# EAGLE design cvpal_v01 (EAGLE 9.7.0)
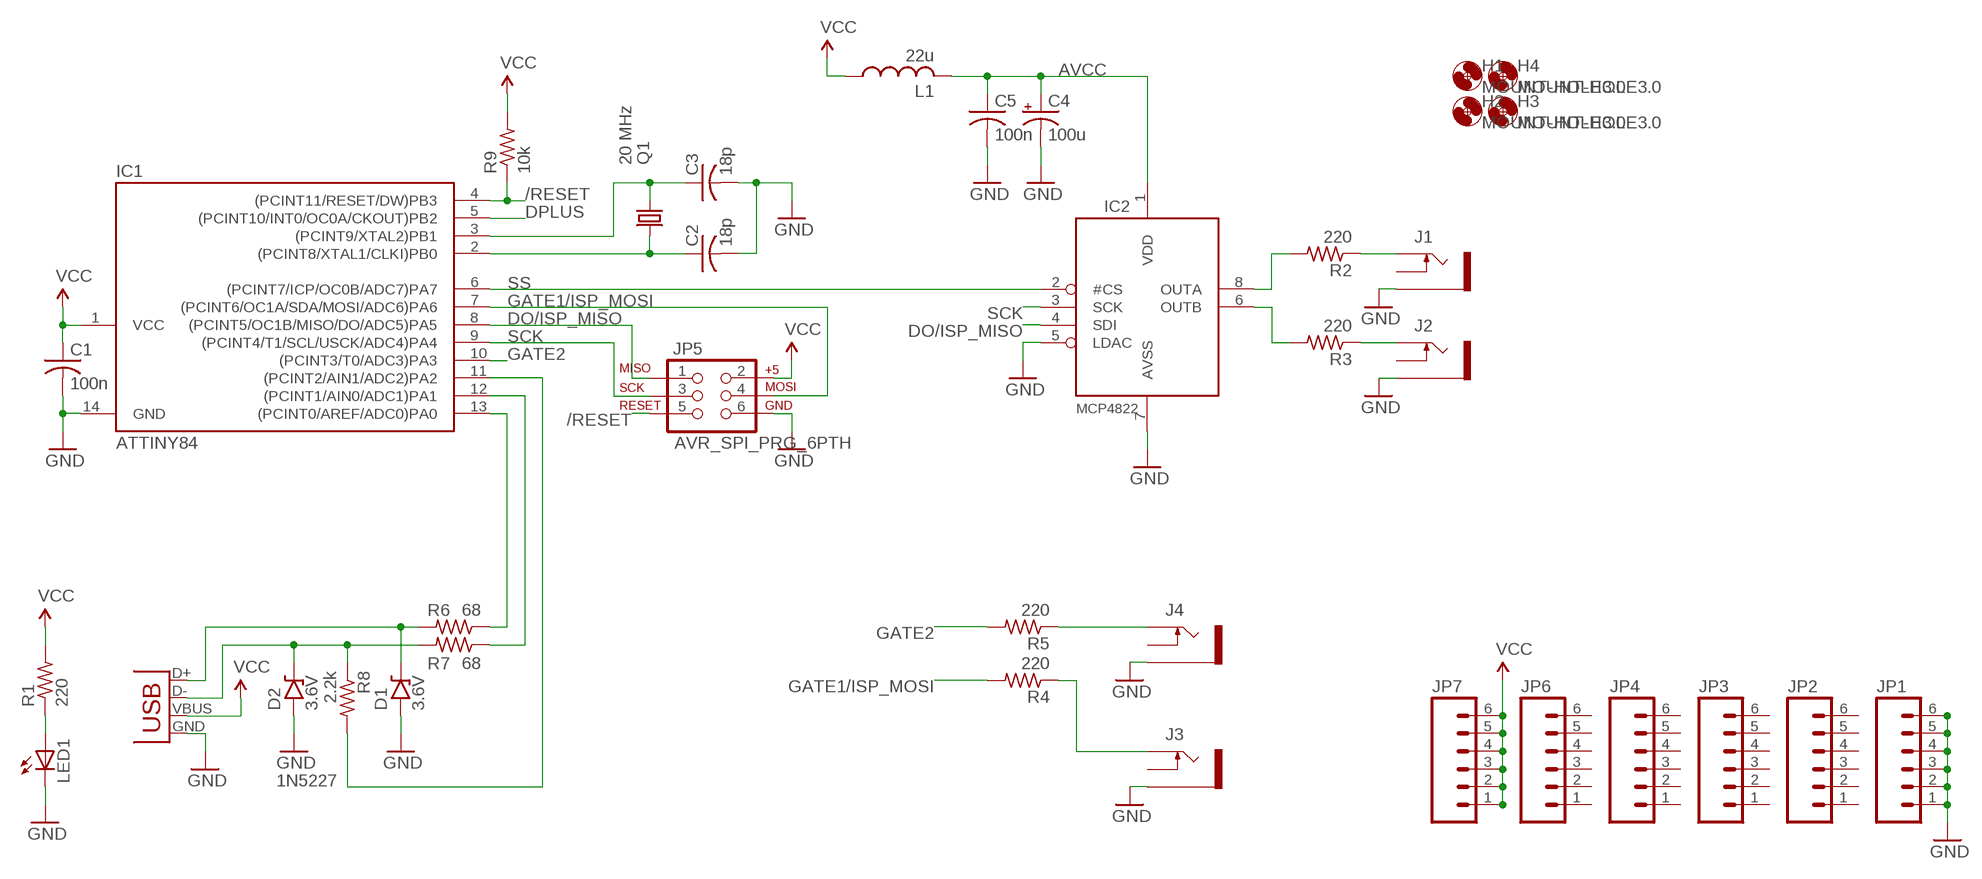
[diagram p0: schematic, sheet 1]

## Parts
C1  100n  C-US025-025X050  [C025-025X050]
C2  18p  C-US025-025X050  [C025-025X050]
C3  18p  C-US025-025X050  [C025-025X050]
C4  100u  CPOL-USE2.5-7  [E2,5-7]
C5  100n  C-US025-025X050  [C025-025X050]
D1  3.6V  1N47XXDO35  [D-5]
D2  3.6V  1N47XXDO35  [D-5]
H1  MOUNT-HOLE3.0  [3,0]
H2  MOUNT-HOLE3.0  [3,0]
H3  MOUNT-HOLE3.0  [3,0]
H4  MOUNT-HOLE3.0  [3,0]
IC1  ATTINY84  ATTINY24/44/84-PU  [DIL14]
IC2  MCP4822  [DIL08]
J1  1503_12  [1503_12]
J2  1503_12  [1503_12]
J3  1503_12  [1503_12]
J4  1503_12  [1503_12]
JP1  M06SIP  [1X06]
JP2  M06SIP  [1X06]
JP3  M06SIP  [1X06]
JP4  M06SIP  [1X06]
JP5  AVR_SPI_PRG_6PTH  [2X3]
JP6  M06SIP  [1X06]
JP7  M06SIP  [1X06]
L1  22u  L-US0207/10  [0207/10]
LED1  LED5MM  [LED5MM]
Q1  20 MHz  CRYSTALHC49S  [HC49/S]
R1  220  R-US_0204/7  [0204/7]
R2  220  R-US_0204/7  [0204/7]
R3  220  R-US_0204/7  [0204/7]
R4  220  R-US_0204/7  [0204/7]
R5  220  R-US_0204/7  [0204/7]
R6  68  R-US_0204/7  [0204/7]
R7  68  R-US_0204/7  [0204/7]
R8  2.2k  R-US_0204/7  [0204/7]
R9  10k  R-US_0204/7  [0204/7]
X2  USBPTH  [USB-B-PTH]

## Nets
/RESET: IC1.4((PCINT11/RESET/DW)PB3) JP5.5 R9.1
AVCC: C4.+ C5.1 IC2.1(VDD) L1.2
CV1: IC2.8(OUTA) R2.2
CV1_R: J1.3 R2.1
CV2: IC2.6(OUTB) R3.2
D+: D1.C R6.2 X2.D+
D-: D2.C R7.2 R8.1 X2.D-
DMINUS: IC1.12((PCINT1/AIN0/ADC1)PA1) R7.1
DO/ISP_MISO: IC1.8((PCINT5/OC1B/MISO/DO/ADC5)PA5) IC2.4(SDI) JP5.1
DPLUS: IC1.5((PCINT10/INT0/OC0A/CKOUT)PB2) IC1.13((PCINT0/AREF/ADC0)PA0) R6.1
GATE1/ISP_MOSI: IC1.7((PCINT6/OC1A/SDA/MOSI/ADC6)PA6) JP5.4 R4.2
GATE2: IC1.10((PCINT3/T0/ADC3)PA3) R5.2
GND: C1.2 C2.2 C3.2 C4.- C5.2 D1.A D2.A IC1.14(GND) IC2.5(LDAC) IC2.7(AVSS) J1.5 J2.5 J3.5 J4.5 JP1.1 JP1.2 JP1.3 JP1.4 JP1.5 JP1.6 JP5.6 LED1.K(C) X2.GND
N$1: LED1.A R1.1
N$2: C3.1 IC1.3((PCINT9/XTAL2)PB1) Q1.1
N$3: C2.1 IC1.2((PCINT8/XTAL1/CLKI)PB0) Q1.2
N$4: J2.3 R3.1
N$5: J4.3 R5.1
N$6: IC1.11((PCINT2/AIN1/ADC2)PA2) R8.2
N$8: J3.3 R4.1
SCK: IC1.9((PCINT4/T1/SCL/USCK/ADC4)PA4) IC2.3(SCK) JP5.3
SS: IC1.6((PCINT7/ICP/OC0B/ADC7)PA7) IC2.2(#CS)
VCC: C1.1 IC1.1(VCC) JP5.2 JP7.1 JP7.2 JP7.3 JP7.4 JP7.5 JP7.6 L1.1 R1.2 R9.2 X2.VBUS
Unconnected: J1.4 J2.4 J3.4 J4.4 JP2.1 JP2.2 JP2.3 JP2.4 JP2.5 JP2.6 JP3.1 JP3.2 JP3.3 JP3.4 JP3.5 JP3.6 JP4.1 JP4.2 JP4.3 JP4.4 JP4.5 JP4.6 JP6.1 JP6.2 JP6.3 JP6.4 JP6.5 JP6.6

## Notes on the sheet
- 1N5227

## Library data of the parts
C1-C3 C5 = rcl:C-US: CAPACITOR, American symbol
C4 = rcl:CPOL-US: POLARIZED CAPACITOR, American symbol
D1 D2 = og-diodes:1N47XX: Zener Diode 1N4728 - 1N4764: 3.3 V - 100V, 10% (1n47xxA 5%); DO-41 glass case
H1-H4 = holes:MOUNT-HOLE: MOUNTING HOLE with drill center marker
IC1 = attiny24_44_84:ATTINY24/44/84
IC2 = og-dac:MCP4822
J1-J4 = og-lumberg:1503_12
JP1-JP4 JP6 JP7 = SparkFun:M06: Header 6 Standard 6-pin 0.1" header. Use with straight break away headers (SKU : PRT-00116), right angle break away headers (PRT-00553), swiss pins (PRT-00743), machine pins (PRT-00117), and female headers (PRT-00115). Molex polarized connector foot print use with SKU : PRT-08094 with associated crimp pins and housings. NOTES ON THE VARIANTS LOCK and LOCK_LONGPADS... This footprint was designed to help hold the alignment of a through-hole component (i.e. 6-pin header) while soldering it into place. You may notice that each hole has been shifted either up or down by 0.005 of an inch from it's more standard position (which is a perfectly straight line). This slight alteration caused the pins (the squares in the middle) to touch the edges of the holes. Because they are alternating, it causes a "brace" to hold the component in place. 0.005 has proven to be the perfect amount of "off-center" position when using our standard breakaway headers. Although looks a little odd when you look at the bare footprint, once you have a header in there, the alteration is very hard to notice. Also, if you push a header all the way into place, it is covered up entirely on the bottom side. This idea of altering the position of holes to aid alignment will be further integrated into the Sparkfun Library for other footprints. It can help hold any component with 3 or more connection pins.
JP5 = SparkFun:AVR_SPI_PRG_6: AVR ISP 6 Pin This is the reduced ISP connector for AVR programming. Common on Arduino. This footprint will take up less PCB space and can be used with a 10-pin to 6-pin adapter such as SKU: BOB-08508
L1 = rcl:L-US: INDUCTOR, American symbol
LED1 = led:LED: LED OSRAM: - CHIPLED LG R971, LG N971, LY N971, LG Q971, LY Q971, LO R971, LY R971 LH N974, LH R974 LS Q976, LO Q976, LY Q976 LO Q996 - Hyper CHIPLED LW Q18S LB Q993, LB Q99A, LB R99A - SideLED LS A670, LO A670, LY A670, LG A670, LP A670 LB A673, LV A673, LT A673, LW A673 LH A674 LY A675 LS A676, LA A676, LO A676, LY A676, LW A676 LS A679, LY A679, LG A679 - Hyper Micro SIDELED® LS Y876, LA Y876, LO Y876, LY Y876 LT Y87S - SmartLED LW L88C, LW L88S LB L89C, LB L89S, LG L890 LS L89K, LO L89K, LY L89K LS L896, LA L896, LO L896, LY L896 - TOPLED LS T670, LO T670, LY T670, LG T670, LP T670 LSG T670, LSP T670, LSY T670, LOP T670, LYG T670 LG T671, LOG T671, LSG T671 LB T673, LV T673, LT T673, LW T673 LH T674 LS T676, LA T676, LO T676, LY T676, LB T676, LH T676, LSB T676, LW T676 LB T67C, LV T67C, LT T67C, LS T67K, LO T67K, LY T67K, LW E67C LS E67B, LA E67B, LO E67B, LY E67B, LB E67C, LV E67C, LT E67C LW T67C LS T679, LY T679, LG T679 LS T770, LO T770, LY T770, LG T770, LP T770 LB T773, LV T773, LT T773, LW T773 LH T774 LS E675, LA E675, LY E675, LS T675 LS T776, LA T776, LO T776, LY T776, LB T776 LHGB T686 LT T68C, LB T68C - Hyper Mini TOPLED® LB M676 - Mini TOPLED Santana® LG M470 LS M47K, LO M47K, LY M47K Source: http://www.osram.convergy.de LUXEON: - LUMILED® LXK2-PW12-R00, LXK2-PW12-S00, LXK2-PW14-U00, LXK2-PW14-V00 LXK2-PM12-R00, LXK2-PM12-S00, LXK2-PM14-U00 LXK2-PE12-Q00, LXK2-PE12-R00, LXK2-PE12-S00, LXK2-PE14-T00, LXK2-PE14-U00 LXK2-PB12-K00, LXK2-PB12-L00, LXK2-PB12-M00, LXK2-PB14-N00, LXK2-PB14-P00, LXK2-PB14-Q00 LXK2-PR12-L00, LXK2-PR12-M00, LXK2-PR14-Q00, LXK2-PR14-R00 LXK2-PD12-Q00, LXK2-PD12-R00, LXK2-PD12-S00 LXK2-PH12-R00, LXK2-PH12-S00 LXK2-PL12-P00, LXK2-PL12-Q00, LXK2-PL12-R00 Source: www.luxeon.com KINGBRIGHT: KA-3528ASYC Source: www.kingbright.com
Q1 = crystal:CRYSTAL: CRYSTAL
R1-R9 = resistor:R-US_: RESISTOR, American symbol
X2 = SparkFun:USB: USB Connectors USB-B-PTH is fully proven SKU : PRT-00139 USB-miniB is fully proven SKU : PRT-00587 USB-A-PCB is untested. USB-A-H is throughly reviewed, but untested. Spark Fun Electronics SKU : PRT-00437 USB-B-SMT is throughly reviewed, but untested. Needs silkscreen touching up. USB-A-S has not been used/tested USB-MB-H has not been used/tested

## Board
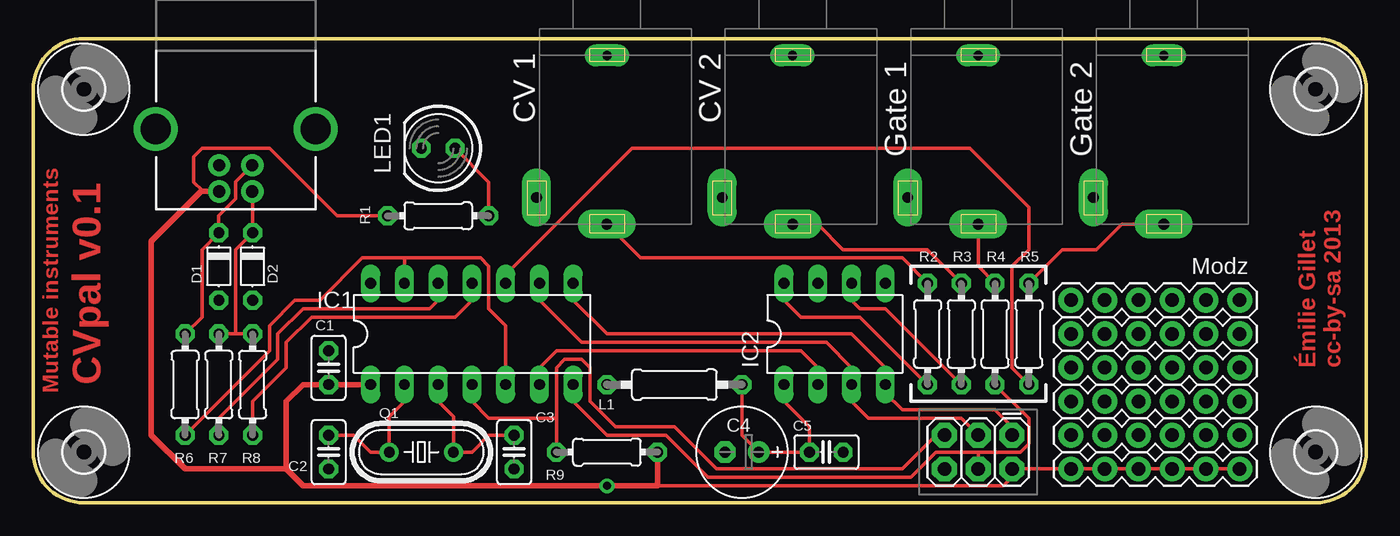
[diagram p1: board, top side]
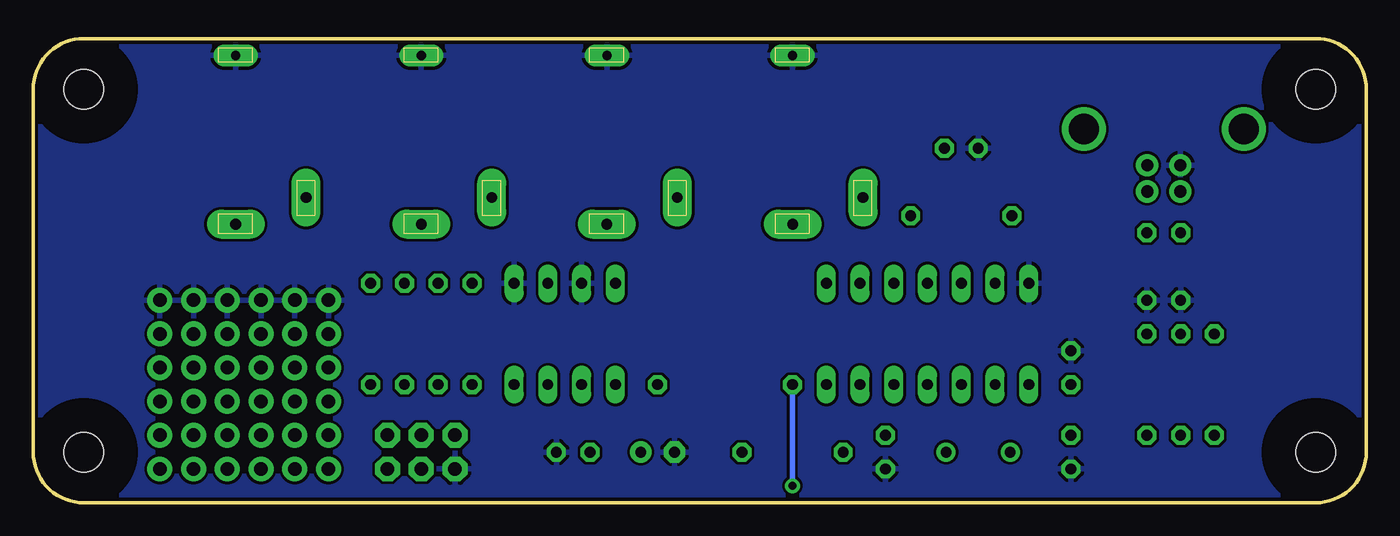
[diagram p2: board, bottom side, seen from below]

Size 100.33 x 34.92 mm. Coordinates in mm from the lower left corner, seen from the top.
Outline: 96.52,0 arc90 100.33,3.81 100.33,31.11 arc90 96.52,34.92 3.81,34.92 arc90 0,31.11 0,3.81 arc90 3.81,0 96.52,0
Copper layers (1*16): Top 0.035mm / dielectric 1.5mm / Bottom 0.035mm
Design rules "SparkFun": minimum track width 8mil, minimum drill 20mil, track to track 8mil, track to pad 8mil, pad to pad 8mil, via to via 8mil, smd to smd 8mil, copper to edge 10mil, drill to drill 8mil, minimum pad ring 12mil, minimum via ring 10mil, stop-mask expansion 4mil, vias tented up to drill 25mil, thermal gap 10mil

### Footprints (pad centres in the part's own frame; a part is rotated, then mirrored left to right if it is on the bottom)
C025-025X050 = drill 0.813 octagon: 1 -1.27,0; 2 1.27,0
E2,5-7 = drill 0.813 pad 1.6: + -1.27,0 | drill 0.813 pad 1.6 octagon: - 1.27,0
D-5 = drill 0.813 octagon: A 2.54,0; C -2.54,0
3,0 = hole 3: 0,0
DIL14 = drill 0.813 long: 1 -7.62,-3.81; 2 -5.08,-3.81; 3 -2.54,-3.81; 4 0,-3.81; 5 2.54,-3.81; 6 5.08,-3.81; 7 7.62,-3.81; 8 7.62,3.81; 9 5.08,3.81; 10 2.54,3.81; 11 0,3.81; 12 -2.54,3.81; 13 -5.08,3.81; 14 -7.62,3.81
DIL08 = drill 0.813 long: 1 -3.81,-3.81; 2 -1.27,-3.81; 3 1.27,-3.81; 4 3.81,-3.81; 5 3.81,3.81; 6 1.27,3.81; 7 -1.27,3.81; 8 -3.81,3.81
1503_12 = drill 0.8 pad 2.184 long: 3 0,0; 4 2,5.3 | drill 0.7 pad 1.67 long: 5 12.7,0
1X06 = drill 1.016 pad 1.88: 1 0,0; 2 2.54,0; 3 5.08,0; 4 7.62,0; 5 10.16,0; 6 12.7,0
2X3 = drill 1.016 pad 1.88 octagon: 1 0,0; 2 0,2.54; 3 2.54,0; 4 2.54,2.54; 5 5.08,0; 6 5.08,2.54
0207/10 = drill 0.813 octagon: 1 -5.08,0; 2 5.08,0
LED5MM = drill 0.813 octagon: A -1.27,0; K 1.27,0
HC49/S = drill 0.813: 1 -2.413,0; 2 2.413,0
0204/7 = drill 0.813 octagon: 1 -3.81,0; 2 3.81,0
USB-B-PTH = drill 0.914 pad 1.676: D+ 0,1.25; D- 1.981,1.25; GND 0,-1.25; VBUS 1.981,-1.25 | drill 2.286: P$1 -2.718,-6.02; P$2 -2.718,6.02

### Placement (x,y rotation side)
C1  22.23,10.16 90 top
C2  22.23,3.81 270 top
C3  36.2,3.81 270 top
C4  53.34,3.81 180 top
C5  59.69,3.81 0 top
D1  13.97,17.78 270 top
D2  16.51,17.78 270 top
H1  96.52,31.11 0 top
H2  96.52,3.81 0 top
H3  3.81,31.11 0 top
H4  3.81,3.81 0 top
IC1  33.02,12.7 0 top
IC2  60.33,12.7 0 top
J1  43.18,20.95 90 top
J2  57.15,20.95 90 top
J3  71.12,20.95 90 top
J4  85.09,20.95 90 top
JP1  78.11,15.24 0 top
JP2  78.11,12.7 0 top
JP3  78.11,10.16 0 top
JP4  78.11,7.62 0 top
JP5  73.66,5.08 180 top
JP6  78.11,5.08 0 top
JP7  78.11,2.54 0 top
L1  48.26,8.89 0 top
LED1  30.48,26.67 180 top
Q1  29.21,3.81 180 top
R1  30.48,21.59 180 top
R2  67.31,12.7 270 top
R3  69.85,12.7 270 top
R4  72.39,12.7 270 top
R5  74.93,12.7 270 top
R6  11.43,8.89 90 top
R7  13.97,8.89 90 top
R8  16.51,8.89 270 top
R9  43.18,3.81 0 top
X2  15.24,25.4 270 top

### Tracks (layer width: path | path; a pad name or v marks a point on that pad's centre or on a via)
/RESET
  Top 0.254: IC1.4 33.02,7.62 34.29,6.35 39.37,6.35 | JP5.5 67.94,5.08 65.41,2.54 51.44,2.54 48.26,5.71 43.81,5.71 41.91,7.62 41.91,10.16 41.27,10.79 40.01,10.79 39.37,10.16 39.37,6.35 | 39.37,6.35 R9.1
AVCC
  Top 0.254: L1.2 53.34,5.08 C4.+ C5.1 58.42,5.71 56.52,7.62 IC2.1
CV1
  Top 0.254: IC2.8 56.52,15.24 57.78,13.97 62.23,13.97 R2.2
CV1_R
  Top 0.254: J1.3 45.72,18.41 65.41,18.41 R2.1
CV2
  Top 0.254: IC2.6 61.59,15.24 62.23,14.61 64.14,14.61 R3.2
D+
  Top 0.254: X2.D+ 15.24,24.15 15.24,22.86 13.97,21.59 D1.C 12.7,19.05 12.7,13.97 R6.2
D-
  Top 0.254: X2.D- 16.51,23.4 D2.C 15.24,19.05 15.24,12.7 | 15.24,12.7 R8.1 | R7.2 15.24,12.7
DMINUS
  Top 0.254: IC1.12 30.48,15.24 29.84,14.61 20.32,14.61 18.41,12.7 18.41,10.79 13.97,6.35 R7.1
DO/ISP_MISO
  Top 0.254: IC1.8 40.64,15.24 43.18,12.7 61.59,12.7 64.14,10.16 IC2.4 64.14,8.26 65.41,6.99 72.39,6.99 73.66,5.71 JP5.1
DPLUS
  Top 0.254: R6.1 17.78,11.43 17.78,13.34 19.68,15.24 21.59,15.24 24.77,18.41 27.94,18.41 | IC1.5 35.56,13.34 34.29,14.61 34.29,17.78 33.66,18.41 27.94,18.41 | 27.94,18.41 IC1.13
GATE1/ISP_MOSI
  Top 0.254: IC1.7 40.64,7.62 43.18,5.08 47.62,5.08 50.8,1.91 66.04,1.91 67.94,3.81 71.12,3.81 | 71.12,3.81 74.3,3.81 74.93,4.45 74.93,6.35 R4.2 | 71.12,3.81 JP5.4
GATE2
  Top 0.254: IC1.10 35.56,17.14 45.09,26.67 70.48,26.67 74.93,22.23 74.93,19.05 73.66,17.78 73.66,10.16 R5.2
GND
  pour Bottom: -2.54,38.1 -2.54,-2.54 102.87,-2.54 102.87,38.1
N$1
  Top 0.254: LED1.A 34.29,24.13 R1.1
N$2
  Top 0.254: IC1.3 30.48,7.62 31.62,6.48 Q1.1 33.02,3.81 34.29,5.08 C3.1
N$3
  Top 0.254: IC1.2 27.94,7.62 26.8,6.48 Q1.2 25.4,3.81 24.13,5.08 C2.1
N$4
  Top 0.254: R3.1 67.31,19.05 60.96,19.05 59.05,20.95 J2.3
N$5
  Top 0.254: J4.3 81.92,20.95 80.01,19.05 77.47,19.05 R5.1
N$6
  Top 0.254: R8.2 16.51,7.62 19.05,10.16 19.05,12.06 20.95,13.97 31.75,13.97 33.02,15.24 IC1.11
N$8
  Top 0.254: R4.1 71.12,17.78 J3.3
SCK
  Top 0.254: IC1.9 38.1,15.24 41.27,12.06 59.69,12.06 61.59,10.16 IC2.3 61.59,7.62 62.87,6.35 69.85,6.35 JP5.3
SS
  Top 0.254: IC2.2 59.05,10.16 57.78,11.43 39.37,11.43 38.1,10.16 IC1.6
VCC  (via drill 0.6)
  Top 0.254: X2.VBUS 13.91,23.5 12.7,23.5 12.06,24.13 12.06,26.04 12.7,26.67 17.78,26.67 22.86,21.59 R1.2 | 46.99,1.27 73.03,1.27 73.66,1.91 JP5.2 JP7.1 JP7.2 JP7.3 JP7.4 JP7.5 JP7.6
  Top 0.406: 19.05,2.54 19.05,7.62 20.32,8.89 C1.1 IC1.1 | 19.05,2.54 11.43,2.54 8.89,5.08 8.89,19.68 12.62,23.42 X2.VBUS | R9.2 46.99,1.27 v43.18,1.27 20.32,1.27 19.05,2.54
  Bottom 0.406: v43.18,1.27 L1.1

### Text on the board
Top: Émilie Gillet | cc-by-sa 2013 | CVpal v0.1 | Mutable instruments
tNames: CV 1 | CV 2 | Gate 1 | Gate 2 | Modz
tStop: Émilie Gillet | cc-by-sa 2013 | CVpal v0.1 | Mutable instruments
tDocu: AVR ISP